# Altium project RW00014SCH.PrjPcb
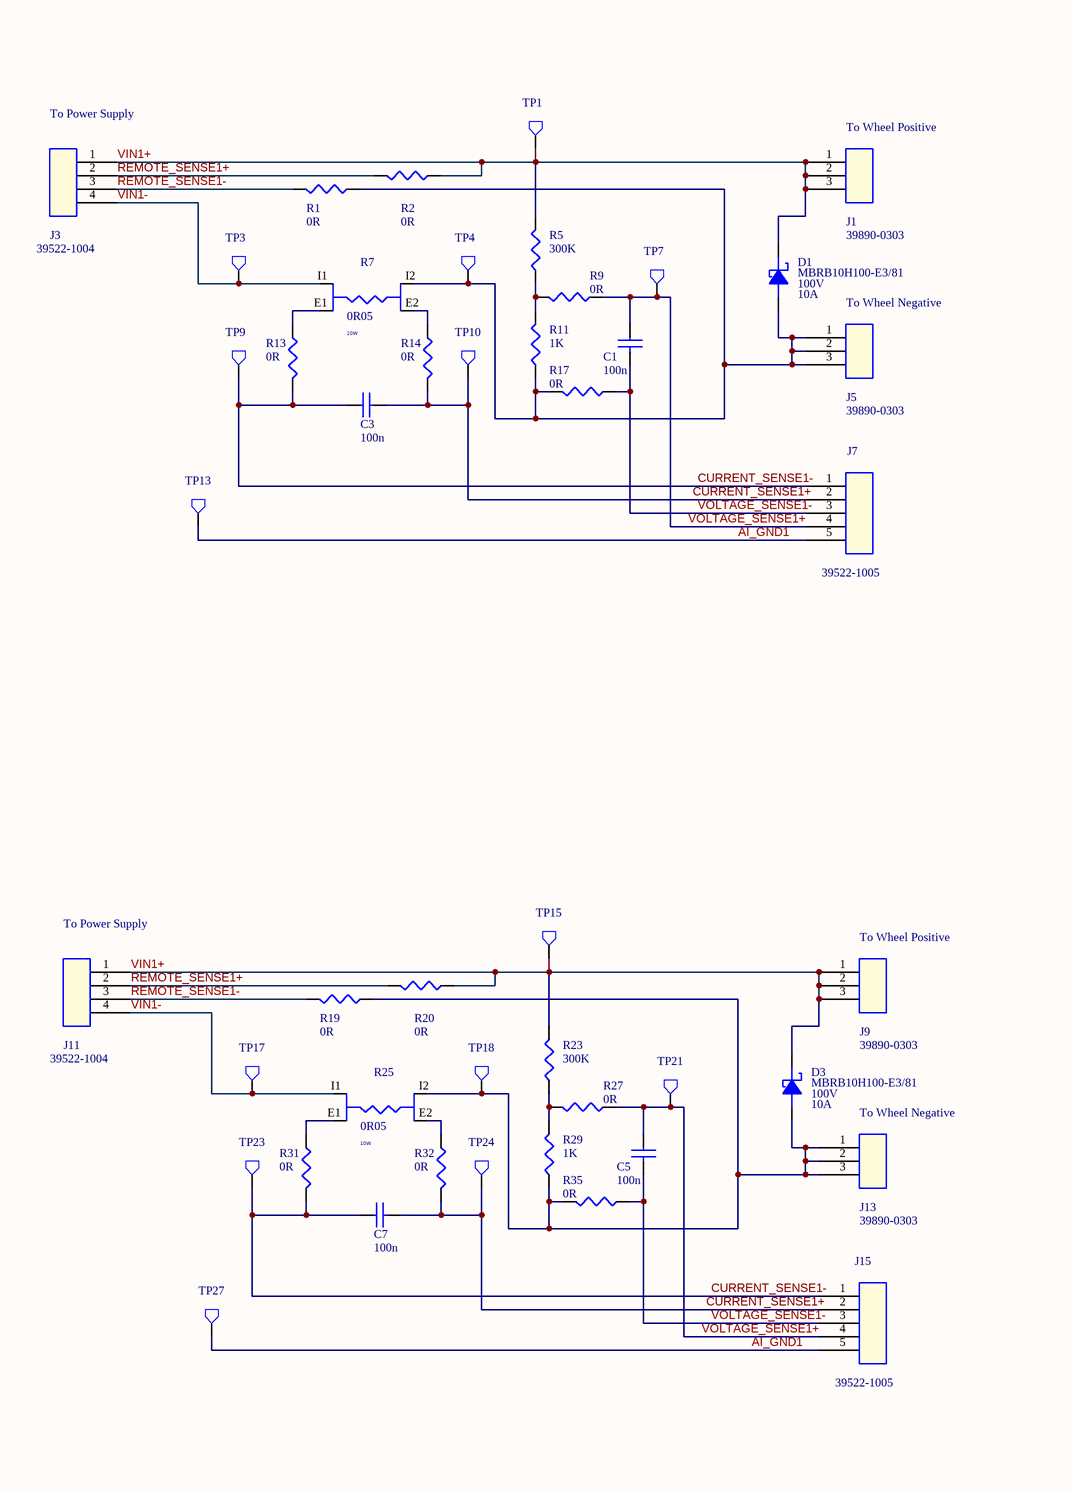
[diagram p0: Top Level.SchDoc, left]
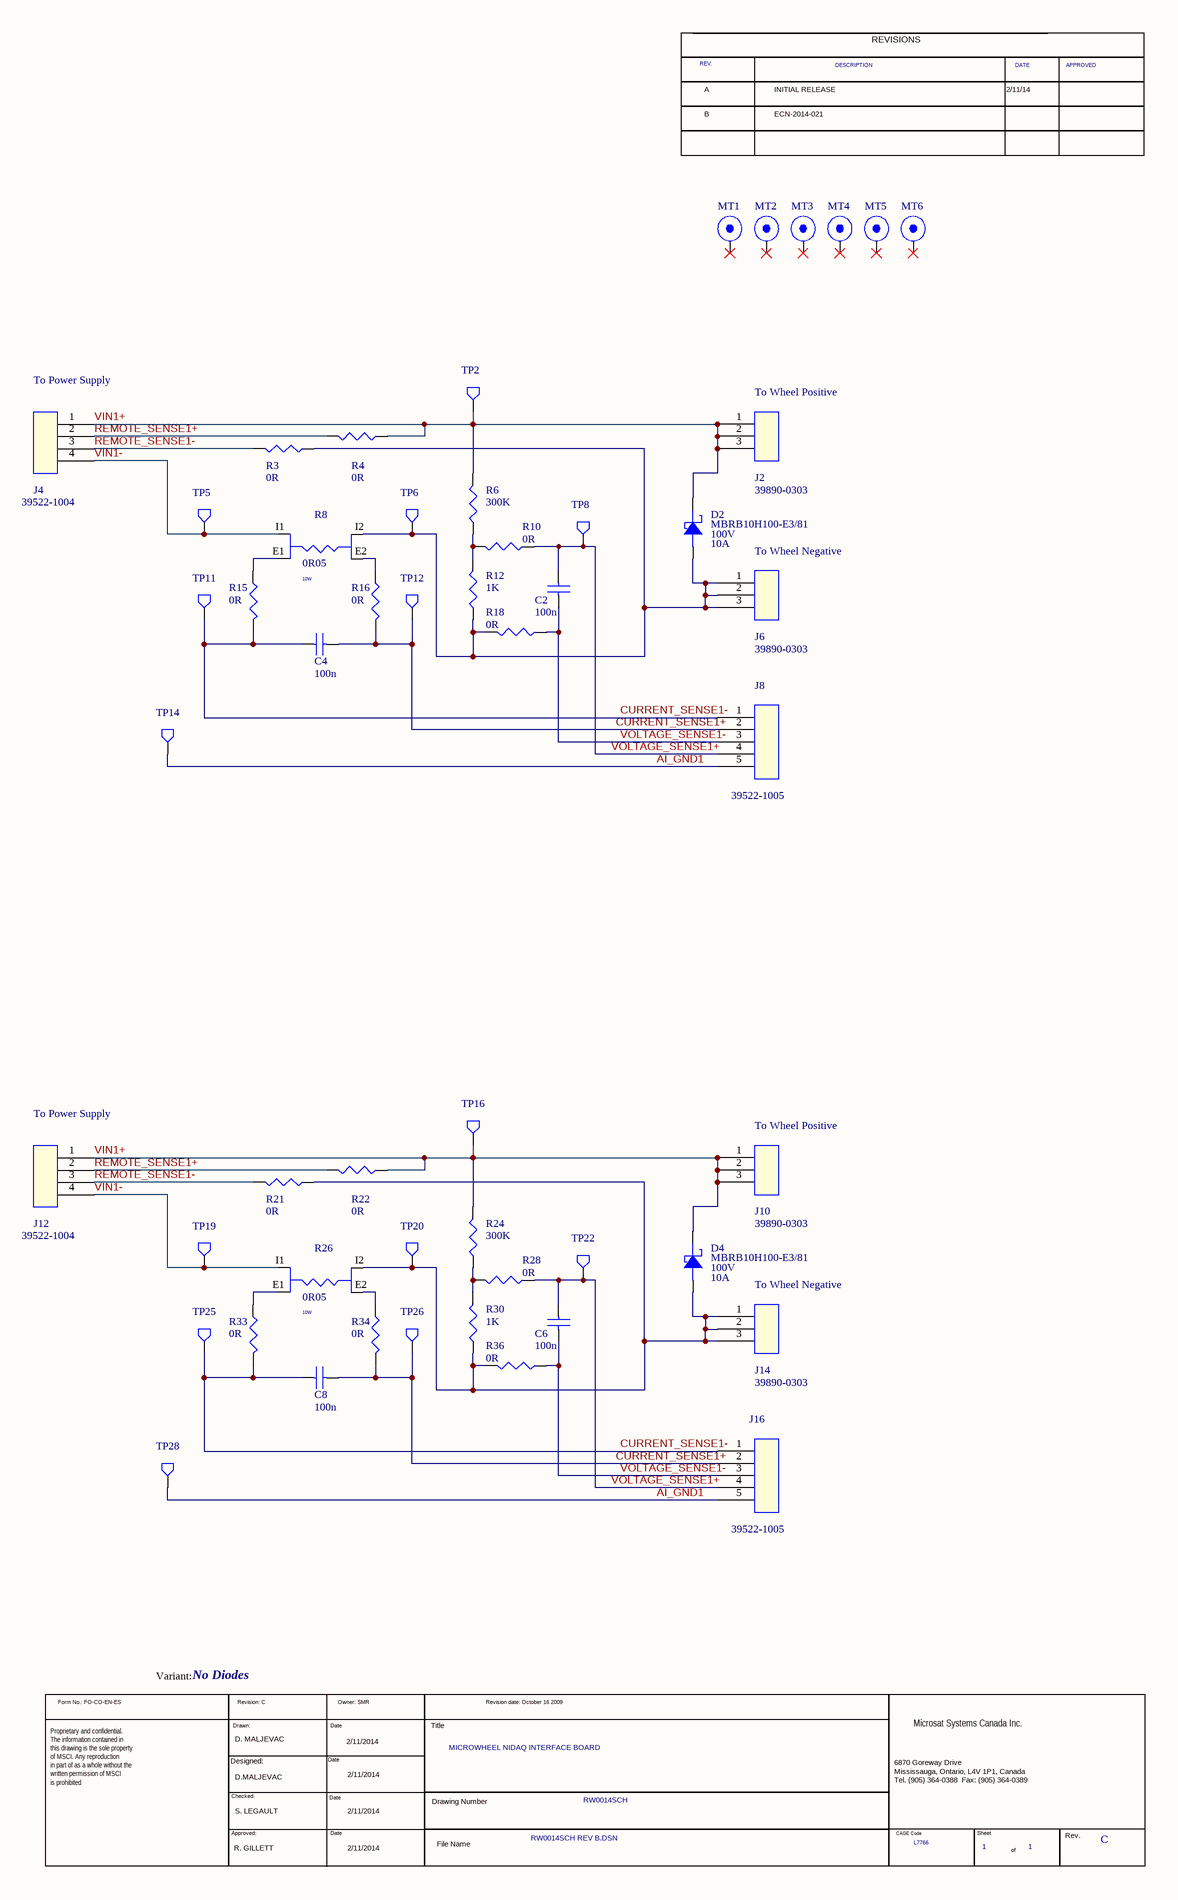
[diagram p1: Top Level.SchDoc, right]
1 sheet, 104 parts. Net scope: global (net labels, ports and power ports of the same name join across sheets).

## Sheet Top Level.SchDoc
size 513 x 386 mm

### Parts
(Parts that share a designator on the sheet are numbered #1, #2 ... from top to bottom, then left to right.)
*#1  Rev_block_header  (value not drawn)  (graphical)
*#2  REV LETTER: REV.  Rev Record: DESCRIPTION  Approved by: APPROVED  (hidden comment: Rev_block_row)  (graphical)
*#3  Rev_row  (value not drawn)  (graphical)
*#4  Rev_row  (value not drawn)  (graphical)
*#5  Rev_row  (value not drawn)  (graphical)
*#6  Cage Code: L7766  FileName: RW0014SCH REV B.DSN  Page Count: 1  Title: MICROWHEEL NIDAQ INTERFACE BOARD  RevCode: C  Doc: RW0014SCH  (hidden comment: MSCITitleBlock)  (graphical)
C1  100n  [C.0805]
C2  100n  [C.0805]
C3  100n  [C.0805]
C4  100n  [C.0805]
C5  100n  [C.0805]
C6  100n  [C.0805]
C7  100n  [C.0805]
C8  100n  [C.0805]
D1  Current: 10A  Voltage: 100V  [SM/DO213AA_21]  (hidden comment: MBRB10H100-E3/81)
D2  Current: 10A  Voltage: 100V  [SM/DO213AA_21]  (hidden comment: MBRB10H100-E3/81)
D3  Current: 10A  Voltage: 100V  [SM/DO213AA_21]  (hidden comment: MBRB10H100-E3/81)
D4  Current: 10A  Voltage: 100V  [SM/DO213AA_21]  (hidden comment: MBRB10H100-E3/81)
J1  39890-0303  [CONN.39890-0303]
J2  39890-0303  [CONN.39890-0303]
J3  39522-1004  [CONN.39522-1004]
J4  39522-1004  [CONN.39522-1004]
J5  39890-0303  [CONN.39890-0303]
J6  39890-0303  [CONN.39890-0303]
J7  39522-1005  [CONN.39522-1005]
J8  39522-1005  [CONN.39522-1005]
J9  39890-0303  [CONN.39890-0303]
J10  39890-0303  [CONN.39890-0303]
J11  39522-1004  [CONN.39522-1004]
J12  39522-1004  [CONN.39522-1004]
J13  39890-0303  [CONN.39890-0303]
J14  39890-0303  [CONN.39890-0303]
J15  39522-1005  [CONN.39522-1005]
J16  39522-1005  [CONN.39522-1005]
MT1  MOUNTING_HOLE  [see guidelines]  (value not drawn)  (no BOM)
MT2  MOUNTING_HOLE  [see guidelines]  (value not drawn)  (no BOM)
MT3  MOUNTING_HOLE  [see guidelines]  (value not drawn)  (no BOM)
MT4  MOUNTING_HOLE  [see guidelines]  (value not drawn)  (no BOM)
MT5  MOUNTING_HOLE  [see guidelines]  (value not drawn)  (no BOM)
MT6  MOUNTING_HOLE  [see guidelines]  (value not drawn)  (no BOM)
R1  0R  [R.0805]
R2  0R  [R.0805]
R3  0R  [R.0805]
R4  0R  [R.0805]
R5  300K  [R.1206]
R6  300K  [R.1206]
R7  0R05  Power: 10W  [TBD]
R8  0R05  Power: 10W  [TBD]
R9  0R  [R.0805]
R10  0R  [R.0805]
R11  1K  [R.1206]
R12  1K  [R.1206]
R13  0R  [R.0805]
R14  0R  [R.0805]
R15  0R  [R.0805]
R16  0R  [R.0805]
R17  0R  [R.0805]
R18  0R  [R.0805]
R19  0R  [R.0805]
R20  0R  [R.0805]
R21  0R  [R.0805]
R22  0R  [R.0805]
R23  300K  [R.1206]
R24  300K  [R.1206]
R25  0R05  Power: 10W  [TBD]
R26  0R05  Power: 10W  [TBD]
R27  0R  [R.0805]
R28  0R  [R.0805]
R29  1K  [R.1206]
R30  1K  [R.1206]
R31  0R  [R.0805]
R32  0R  [R.0805]
R33  0R  [R.0805]
R34  0R  [R.0805]
R35  0R  [R.0805]
R36  0R  [R.0805]
TP1  TEST POINT  [TH.0.063"]  (value not drawn)
TP2  TEST POINT  [TH.0.063"]  (value not drawn)
TP3  TEST POINT  [TH.0.063"]  (value not drawn)
TP4  TEST POINT  [TH.0.063"]  (value not drawn)
TP5  TEST POINT  [TH.0.063"]  (value not drawn)
TP6  TEST POINT  [TH.0.063"]  (value not drawn)
TP7  TEST POINT  [TH.0.063"]  (value not drawn)
TP8  TEST POINT  [TH.0.063"]  (value not drawn)
TP9  TEST POINT  [TH.0.063"]  (value not drawn)
TP10  TEST POINT  [TH.0.063"]  (value not drawn)
TP11  TEST POINT  [TH.0.063"]  (value not drawn)
TP12  TEST POINT  [TH.0.063"]  (value not drawn)
TP13  TEST POINT  [TH.0.063"]  (value not drawn)
TP14  TEST POINT  [TH.0.063"]  (value not drawn)
TP15  TEST POINT  [TH.0.063"]  (value not drawn)
TP16  TEST POINT  [TH.0.063"]  (value not drawn)
TP17  TEST POINT  [TH.0.063"]  (value not drawn)
TP18  TEST POINT  [TH.0.063"]  (value not drawn)
TP19  TEST POINT  [TH.0.063"]  (value not drawn)
TP20  TEST POINT  [TH.0.063"]  (value not drawn)
TP21  TEST POINT  [TH.0.063"]  (value not drawn)
TP22  TEST POINT  [TH.0.063"]  (value not drawn)
TP23  TEST POINT  [TH.0.063"]  (value not drawn)
TP24  TEST POINT  [TH.0.063"]  (value not drawn)
TP25  TEST POINT  [TH.0.063"]  (value not drawn)
TP26  TEST POINT  [TH.0.063"]  (value not drawn)
TP27  TEST POINT  [TH.0.063"]  (value not drawn)
TP28  TEST POINT  [TH.0.063"]  (value not drawn)

### Nets
AI_GND1: J7.5 J8.5 J15.5 J16.5 TP13.1(TP) TP14.1(TP) TP27.1(TP) TP28.1(TP)
CURRENT_SENSE1+: C3.2 C4.2 C7.2 C8.2 J7.2 J8.2 J15.2 J16.2 R14.2 R16.2 R32.2 R34.2 TP10.1(TP) TP12.1(TP) TP24.1(TP) TP26.1(TP)
CURRENT_SENSE1-: C3.1 C4.1 C7.1 C8.1 J7.1 J8.1 J15.1 J16.1 R13.2 R15.2 R31.2 R33.2 TP9.1(TP) TP11.1(TP) TP23.1(TP) TP25.1(TP)
REMOTE_SENSE1+: J3.2 J4.2 J11.2 J12.2 R2.2 R4.2 R20.2 R22.2
REMOTE_SENSE1-: J3.3 J4.3 J11.3 J12.3 R1.2 R3.2 R19.2 R21.2
VIN1+: D1.K(CATHODE) D2.K(CATHODE) D3.K(CATHODE) D4.K(CATHODE) J1.1 J1.2 J1.3 J2.1 J2.2 J2.3 J3.1 J4.1 J9.1 J9.2 J9.3 J10.1 J10.2 J10.3 J11.1 J12.1 R2.1 R4.1 R5.2 R6.2 R20.1 R22.1 R23.2 R24.2 TP1.1(TP) TP2.1(TP) TP15.1(TP) TP16.1(TP)
VIN1-: J3.4 J4.4 J11.4 J12.4 R7.I1 R8.I1 R25.I1 R26.I1 TP3.1(TP) TP5.1(TP) TP17.1(TP) TP19.1(TP)
VOLTAGE_SENSE1+: C1.1 C2.1 C5.1 C6.1 J7.4 J8.4 J15.4 J16.4 R9.1 R10.1 R27.1 R28.1 TP7.1(TP) TP8.1(TP) TP21.1(TP) TP22.1(TP)
VOLTAGE_SENSE1-: C1.2 C2.2 C5.2 C6.2 J7.3 J8.3 J15.3 J16.3 R17.1 R18.1 R35.1 R36.1
NetD1_A: D1.A(ANODE) J5.1 J5.2 J5.3 R1.1 R7.I2 R11.1 R17.2 TP4.1(TP)
NetD2_A: D2.A(ANODE) J6.1 J6.2 J6.3 R3.1 R8.I2 R12.1 R18.2 TP6.1(TP)
NetD3_A: D3.A(ANODE) J13.1 J13.2 J13.3 R19.1 R25.I2 R29.1 R35.2 TP18.1(TP)
NetD4_A: D4.A(ANODE) J14.1 J14.2 J14.3 R21.1 R26.I2 R30.1 R36.2 TP20.1(TP)
NetR5_1: R5.1 R9.2 R11.2
NetR6_1: R6.1 R10.2 R12.2
NetR7_E1: R7.E1 R13.1
NetR7_E2: R7.E2 R14.1
NetR8_E1: R8.E1 R15.1
NetR8_E2: R8.E2 R16.1
NetR23_1: R23.1 R27.2 R29.2
NetR24_1: R24.1 R28.2 R30.2
NetR25_E1: R25.E1 R31.1
NetR25_E2: R25.E2 R32.1
NetR26_E1: R26.E1 R33.1
NetR26_E2: R26.E2 R34.1

Not connected (* = marked no-connect by the designer): MT1 1(CENTER)*; MT2 1(CENTER)*; MT3 1(CENTER)*; MT4 1(CENTER)*; MT5 1(CENTER)*; MT6 1(CENTER)*

### Notes on the sheet
- (near *#3) A
- (near *#4) B
- INITIAL RELEASE
- ECN-2014-021
- 2/11/14
- (near J3) To Power Supply
- (near J1) To Wheel Positive
- (near J4) To Power Supply
- (near J2) To Wheel Positive
- (near J5) To Wheel Negative
- (near J6) To Wheel Negative
- (near J11) To Power Supply
- (near J9) To Wheel Positive
- (near J12) To Power Supply
- (near J10) To Wheel Positive
- (near J13) To Wheel Negative
- (near J14) To Wheel Negative
- Variant:
- No Diodes
- D. MALJEVAC
- D.MALJEVAC
- 2/11/2014
- S. LEGAULT
- R. GILLETT
- (in symbol MSCITitleBlock) Form No.: FO-CO-EN-ES; Revision: C; Owner: SMR; Revision date: October 16 2009; Drawn:; Date; Title; Microsat Systems Canada Inc.; Designed:; Checked:; Drawing Number; 6870 Goreway Drive / Mississauga, Ontario, L4V 1P1, Canada / Tel. (905) 364-0388  Fax: (905) 364-0389; Approved:; CAGE Code; Sheet; Rev.; Proprietary and confidential. / The information contained in / this drawing is the sole property / of MSCI. Any reproduction / in part of as a whole without the / written permission of MSCI / is prohibited; File Name; of
- (in symbol Rev_block_header) REVISIONS

### Library data of the parts
*#1 = Rev_block_header: REV LETTER: REV.; Rev Record: DESCRIPTION; RevCode: B; Cage Code: L7766; Page Number: 1; Date: DATE; Drawn by: dw; Checked by: ch; Approved by: APPROVED; Page Count: 1
*#2 = Rev_block_row: RevCode: B; Cage Code: L7766; Page Number: 1; Date: DATE; Drawn by: dw; Checked by: ch; Page Count: 1
*#3-*#5 = Rev_row: Rev Record: DESCRIPTION; REV LETTER: REV.; RevCode: B; Cage Code: L7766; Page Number: 1; Approved by: APPROVED; Checked by: ch; Drawn by: dw; Date: DATE; Page Count: 1
*#6 = MSCITitleBlock: Fabrication Dwg No: FABDWGNO; Assy Dwg No: ASSYDWGNO; Drawn: DN; Page Size: A; Checked: CHK; Approved: APV; Product_Name: PRODUCT NAME; DWN_Date: 5/17/2013; Page Number: 1; Page Create Date: March  8, 1995; CHK_Date: MMM DD, YY; APV_Date: MMM DD, YY
C1 C2 C5 C6 = MIL-PRF-55681 - Cap, Cer: Film Capacitors .1uF 250volt 5%; Part Number: MKP1841410254; Manufacturer: Kemet; Populate: YES; Voltage: 100V; Tolerance: 5%; Value: 100n; ROHS: *; Height: *; Cleaning: *
C3 C4 C7 C8 = MIL-PRF-55681 - Cap, Cer: Film Capacitors .1uF 250volt 5%; Manufacturer: Vishay; Part Number: MKP1841410254; Voltage: 250V; Populate: YES; Tolerance: 5%; ROHS: *; Height: *; Cleaning: *
D1-D4 = DIODE SCHOTTKY: DIODE SCHOTTKY 100V 10A TO236AB; Manufacturer: Vishay Semiconductor; Populate: Yes; PCB Footprint: TO-263AB; Cleaning: WT; Part Number: MBRB10H100-E3/81; Value: MBRB10H100-E3/81; ROHS: ROHS; Height: 1.135
J1 J2 J9 J10 = CON3: CONN, SCREW TERMINAL BLOCK, 3 POS, 5MM SPACING, TH; Manufacturer: Molex; MSCI: 9173; Populate: YES; PCB Footprint: CONN.39890-0303; Part Number: 39890-0303; ROHS: *; Cleaning: *; Height: *; Value: *
J3 J4 J11 J12 = CON4: CONN, TERMINAL BLOCK HEADER, 4 POS, RIGHT ANGLE, 5MM SPACING, TH; Manufacturer: Molex; MSCI: 9171; Populate: YES; PCB Footprint: CONN.39522-1004; Part Number: 39522-1004; ROHS: *; Cleaning: *; Height: *; Value: *
J5 J6 J13 J14 = CON3: CONN, SCREW TERMINAL BLOCK, 3 POS, 5MM SPACING, TH; Manufacturer: Molex; Populate: YES; MSCI: 9173; PCB Footprint: CONN.39890-0303; Part Number: 39890-0303; ROHS: *; Cleaning: *; Height: *; Value: *
J7 J8 J15 J16 = CON5: CONN, TERMINAL BLOCK HEADER, 5 POS, RIGHT ANGLE, 5MM SPACING, TH; Manufacturer: Molex; Populate: YES; MSCI: 9172; PCB Footprint: CONN.39522-1005; Part Number: 39522-1005; ROHS: *; Cleaning: *; Height: *; Value: *
MT1-MT6 = MOUNTING_HOLE: MOUNTING HOLE, PLATED TH, 0.150" HOLE, 0.350" DIAMETER, TH; PCB Footprint: TH.0.150"X0.350"; Populate: DNP; MaxQualTemp: +50; ManufPartNum: N/A; MSCI: N/A; ManufName: N/A; Part Number: N/A; Manufacturer: N/A
R1-R4 R9 R10 R13-R22 R27 R28 R31-R36 = MIL-PRF-55342 - Res, Chip_0: RES, 0R0, 0W125, 0805; Manufacturer: Panasonic; Part Number: ERJ-6GEY0R00V; Tolerance: 0.1%; MSCI: 9179; Populate: YES; Cleaning: WT; Power: 0W125; PCB Footprint: R.0805; Height: *; Value: 0R; ROHS: YES
R5 R6 R23 R24 = MIL-PRF-55342 - Res, Chip_0: RES, 300K0, 0.1%, 0W125, 1206; Part Number: ERA-8AEB304V; Manufacturer: Panasonic; Populate: YES; MSCI: 9185; Tolerance: 0%1; PCB Footprint: R.1206; ROHS: *; Height: *; Cleaning: *; Value: 300K
R7 R8 R25 R26 = LVK24_RES_2: RES, 0R05, 0.1%, 2W, 3637; Manufacturer: Ohmite; Part Number: CS10DR050E; Populate: YES; Tolerance: 0.1%; Height: TBD; Cleaning: *; Value: 0R05
R11 R12 R29 R30 = MIL-PRF-55342 - Res, Chip_0: RES, 1K0, 0.1%, 1W0, 1206; Manufacturer: Vishay Thin Film; Part Number: PHP01206E1001BST5; Populate: YES; MSCI: 9175; Tolerance: 0%1; PCB Footprint: R.1206; ROHS: *; Height: *; Cleaning: *; Value: 1K
TP1 TP2 TP10 TP12 TP15 TP16 TP24 TP26 = TEST POINT: TEST POINT, RED, COMPACT PC, LOOP, 0.125" DIAMETER, TH.0.063"; Manufacturer: Keystone Electronics; Part Number: 5005; MSCI: 9177; Populate: YES; Value: 5005; PCB Footprint: TH.0.063"; ROHS: YES; Height: TBD
TP3-TP6 TP9 TP11 TP17-TP20 TP23 TP25 = TEST POINT: TEST POINT, RED, COMPACT PC, LOOP, 0.125" DIAMETER, TH.0.063"; Part Number: 5005; Manufacturer: Keystone Electronics; MSCI: 9177; Populate: YES; Value: 5005; PCB Footprint: TH.0.063"; ROHS: YES; Height: TBD
TP7 TP8 TP21 TP22 = TEST POINT: TEST POINT, RED, COMPACT PC, LOOP, 0.125" DIAMETER, TH.0.063"; Manufacturer: Keystone Electronics; Part Number: 5005; Populate: YES; MSCI: 9177; Value: 5005; PCB Footprint: TH.0.063"; ROHS: YES; Height: TBD
TP13 TP14 TP27 TP28 = TEST POINT: TEST POINT, RED, COMPACT PC, LOOP, 0.125" DIAMETER, TH.0.063"; Part Number: 5005; Manufacturer: Keystone Electronics; Populate: YES; MSCI: 9177; Value: 5005; PCB Footprint: TH.0.063"; ROHS: YES; Height: TBD

## Assembly variants
Filtered: all parts fitted
Variant without diodes: not fitted D1 D2 D3 D4